# Altium schematic sheet DCDC_4805.SchDoc: 48-5V DC/DC Converter
size Letter; Author: William Peyton; Organization: Colorado School of Mines; Address1: 1500 Illinois St.; Address2: Golden; Address3: CO 80401; Address4: USA; DocumentNumber: 2; Revision: 1.0; SheetNumber: 1; SheetTotal: 1
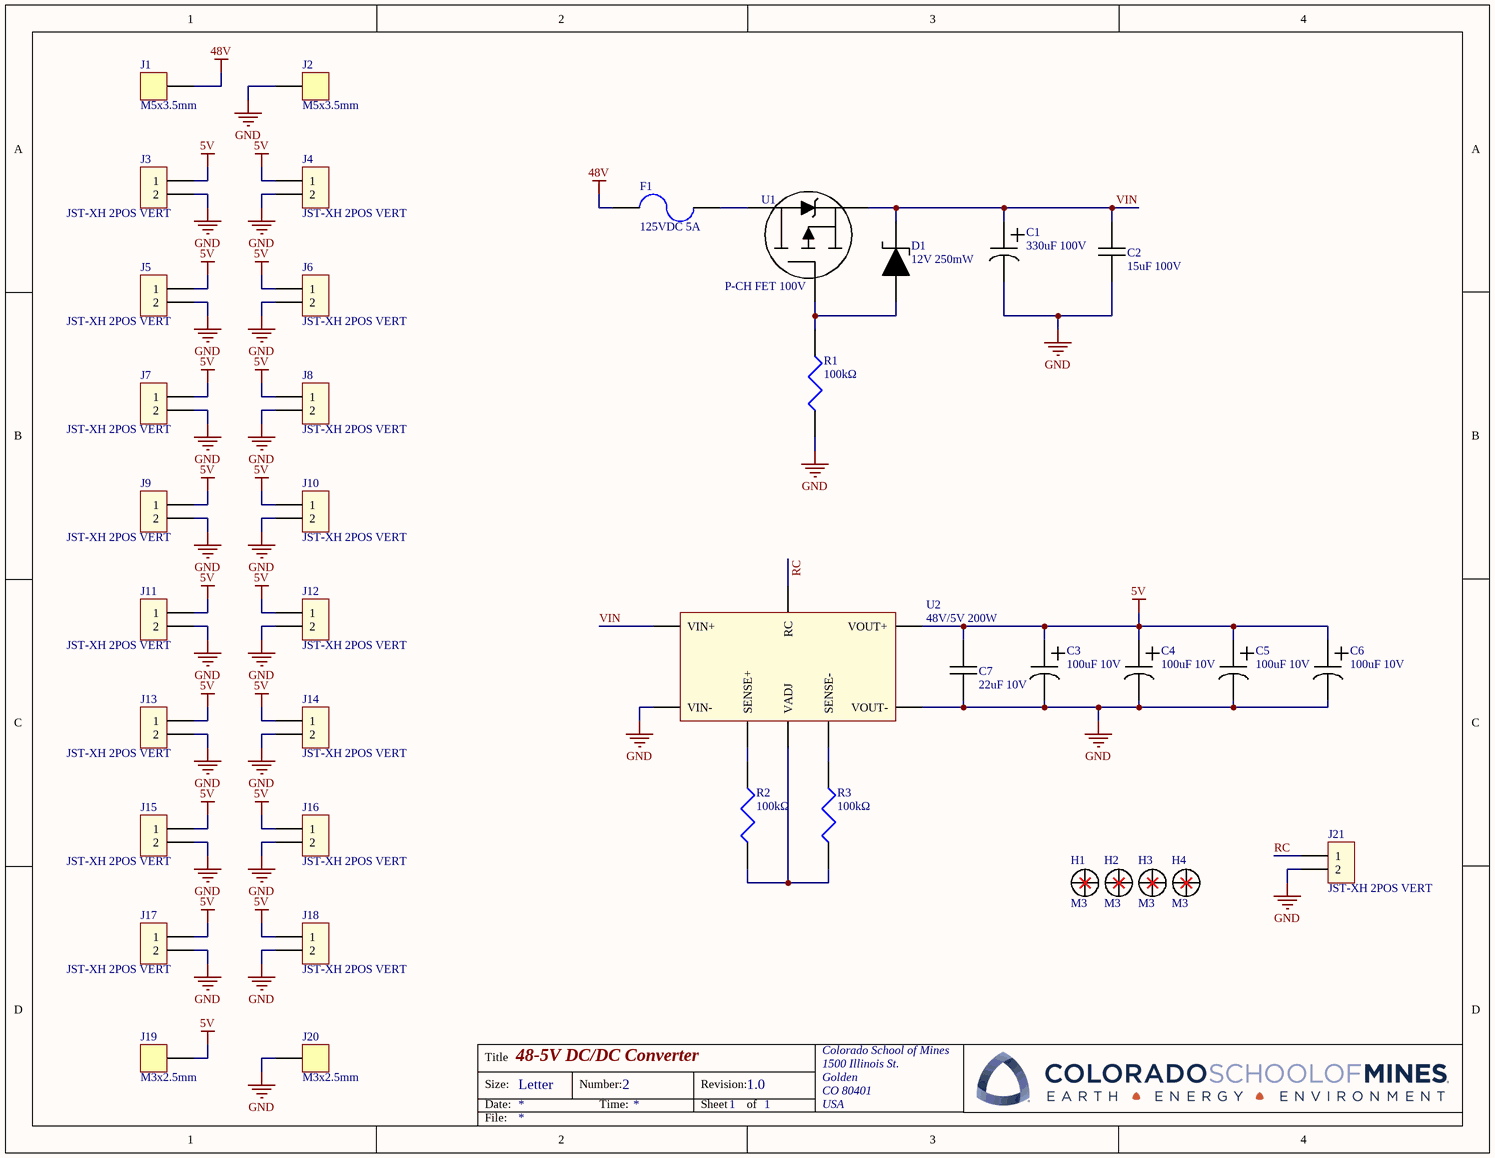
[diagram p0: DCDC_4805.SchDoc]

## Parts
C1  330uF 100V  [EEV-FK2A331M]
C2  15uF 100V  [C2220M Generic]
C3  100uF 10V  [865080243007]
C4  100uF 10V  [865080243007]
C5  100uF 10V  [865080243007]
C6  100uF 10V  [865080243007]
C7  22uF 10V  [885012107011]
D1  12V 250mW  [BZX84-C12,235]
F1  125VDC 5A  [0154005.DRL]
H1  M3  [M3_MOUNTING_HOLE]
H2  M3  [M3_MOUNTING_HOLE]
H3  M3  [M3_MOUNTING_HOLE]
H4  M3  [M3_MOUNTING_HOLE]
J1  M5x3.5mm  [74655095]
J2  M5x3.5mm  [74655095]
J3  JST-XH 2POS VERT  [FP-B2B-XH-A_LF_SN-MFG]
J4  JST-XH 2POS VERT  [FP-B2B-XH-A_LF_SN-MFG]
J5  JST-XH 2POS VERT  [FP-B2B-XH-A_LF_SN-MFG]
J6  JST-XH 2POS VERT  [FP-B2B-XH-A_LF_SN-MFG]
J7  JST-XH 2POS VERT  [FP-B2B-XH-A_LF_SN-MFG]
J8  JST-XH 2POS VERT  [FP-B2B-XH-A_LF_SN-MFG]
J9  JST-XH 2POS VERT  [FP-B2B-XH-A_LF_SN-MFG]
J10  JST-XH 2POS VERT  [FP-B2B-XH-A_LF_SN-MFG]
J11  JST-XH 2POS VERT  [FP-B2B-XH-A_LF_SN-MFG]
J12  JST-XH 2POS VERT  [FP-B2B-XH-A_LF_SN-MFG]
J13  JST-XH 2POS VERT  [FP-B2B-XH-A_LF_SN-MFG]
J14  JST-XH 2POS VERT  [FP-B2B-XH-A_LF_SN-MFG]
J15  JST-XH 2POS VERT  [FP-B2B-XH-A_LF_SN-MFG]
J16  JST-XH 2POS VERT  [FP-B2B-XH-A_LF_SN-MFG]
J17  JST-XH 2POS VERT  [FP-B2B-XH-A_LF_SN-MFG]
J18  JST-XH 2POS VERT  [FP-B2B-XH-A_LF_SN-MFG]
J19  M3x2.5mm  [74650073]
J20  M3x2.5mm  [74650073]
J21  JST-XH 2POS VERT  [FP-B2B-XH-A_LF_SN-MFG]
R1  100kΩ  [RMCF0805]
R2  100kΩ  [RMCF0805]
R3  100kΩ  [RMCF0805]
U1  P-CH FET 100V  [IRF9530NSTRLPBF]
U2  48V/5V 200W  [PKB4211DPI]

## Nets
5V: C3.1 C4.1 C5.1 C6.1 C7.1 J3.1 J4.1 J5.1 J6.1 J7.1 J8.1 J9.1 J10.1 J11.1 J12.1 J13.1 J14.1 J15.1 J16.1 J17.1 J18.1 J19.1 U2.8(VOUT+)
48V: F1.1 J1.1
GND: C1.2 C2.1 C3.2 C4.2 C5.2 C6.2 C7.2 J2.1 J3.2 J4.2 J5.2 J6.2 J7.2 J8.2 J9.2 J10.2 J11.2 J12.2 J13.2 J14.2 J15.2 J16.2 J17.2 J18.2 J20.1 J21.2 R1.1 U2.3(VIN-) U2.4(VOUT-)
RC: J21.1 U2.2(RC)
VIN: C1.1 C2.2 D1.3 U1.3 U2.1(VIN+)
NetD1_1: D1.1 R1.2 U1.1
NetF1_2: F1.2 U1.4
NetR2_1: R2.1 R3.1 U2.6(VADJ)
NetR2_2: R2.2 U2.7(SENSE+)
NetR3_2: R3.2 U2.5(SENSE-)

Not connected (* = marked no-connect by the designer): H1 1*; H2 1*; H3 1*; H4 1*

## Notes on the sheet
- Title
- Size:
- Date:
- Letter
- Number:
- Time:
- Revision:
- Sheet
- of
- File:

## Library data of the parts
C1 = EEV-FK2A331M: Panasonic CAP ALUM 330UF 20% 100V SMD; Manufacturer: Panasonic Electronic Components; ComponentLink1Description: DigiKey; ComponentLink1URL: https://www.digikey.com/en/products/detail/panasonic-electronic-components/EEV-FK2A331M/408248; Part Number: EEV-FK2A331M; Value: 330uF 100V
C2 = C5750X7S2A156M250KB: TDK CAP CER 15UF 100V X7S 2220; Manufacturer: TDK Corporation; ComponentLink1Description: DigiKey; ComponentLink1URL: https://www.digikey.com/en/products/detail/tdk-corporation/C5750X7S2A156M250KB/2443522; Part Number: C5750X7S2A156M250KB; Value: 15uF 100V
C3-C6 = 865080243007: Wurth CAP ALUM POLY 100UF 20% 10V SMD; Manufacturer: Würth Elektronik; ComponentLink1Description: DigiKey; ComponentLink1URL: https://www.digikey.com/en/products/detail/w%C3%BCrth-elektronik/865080243007/5728085; Part Number: 865080243007; Value: 100uF 10V
C7 = 885012107011: Wurth CAP CER 22UF 10V X5R 0805; Manufacturer: Würth Elektronik; Part Number: 885012107011; Value: 22uF 10V; ComponentLink1Description: DigiKey; ComponentLink1URL: https://www.digikey.com/en/products/detail/w%C3%BCrth-elektronik/885012107011/5453476
D1 = BZX84-C12,235: Nexperia DIODE ZENER 12V 250MW TO236AB; ComponentLink1Description: DigiKey; ComponentLink1URL: https://www.digikey.com/en/products/detail/nexperia-usa-inc/BZX84-C12-235/5221767; Part Number: BZX84-C12,235; Manufacturer: Nexperia; Value: 12V 250mW
F1 = 0154005.DRL: Littelfuse FUSE BRD MNT 5A 125VAC/VDC 2SMD; Part Number: 0456030.ER0154005.DRL; Manufacturer: Littelfuse; Value: 125VDC 5A; ComponentLink1Description: DigiKey; ComponentLink1URL: https://www.digikey.com/en/products/detail/littelfuse-inc/0154005-DRL/2520370
H1-H4 = M3_Mounting_Hole: MECHANICAL M3 Mounting Hole
J1 J2 = 74655095R: Wurth WP-THRBU REDCUBE THR internal through-hole thread, 10x10mm, M5x3.5mm, 8 pins, 85A; Manufacturer: Wurth Elektronik; Pin Number: 8; Thread: M5; Surface: Tin; Thread Length: 3.5mm; ComponentLink1Description: Manufacturer; ComponentLink1URL: http://www.we-online.de; ComponentLink2Description: Datasheet; ComponentLink2URL: https://katalog.we-online.com/em/datasheet/74655095R.pdf; Operating Temperature: -55 to +150degC; Height: 4mm; Material: Brass; Part Number: 74655095R; Packaging: Tape and Reel; Mounting Technology: SMT; Rated Current: 85A; Publisher: Wurth Elektronik; Published Date: September 2019; Size: 10x10mm; Value: M5x3.5mm
J3-J18 J21 = B2B-XH-A(LF)(SN): JST XH CONN HEADER VERT 2POS 2.5MM; ComponentLink2Description: Datasheet; ComponentLink2URL: http://www.jst-mfg.com/product/pdf/eng/eXH.pdf?5d9b3ba19c79b; Manufacturer: JST; Part Number: B2B-XH-A(LF)(SN); Value: JST-XH 2POS VERT
J19 J20 = 74650073R: Wurth WP-THRBU REDCUBE THR internal through-hole thread, 7x7mm, M3x2.5mm, 4 pins, 50A; Manufacturer: Wurth Elektronik; Pin Number: 4; Thread: M3; Surface: Tin; Thread Length: 2.5mm; ComponentLink1Description: Manufacturer; ComponentLink1URL: http://www.we-online.de; ComponentLink2Description: Datasheet; ComponentLink2URL: https://katalog.we-online.com/em/datasheet/74650073R.pdf; Operating Temperature: -55 to +150degC; Height: 3mm; Material: Brass; Part Number: 74650073R; Packaging: Tape and Reel; Mounting Technology: SMT; Rated Current: 50A; Publisher: Wurth Elektronik; Published Date: September 2019; Size: 7x7mm; Value: M3x2.5mm
R1-R3 = RMCF0805FT100K: Stackpole RES 100K OHM 1% 1/8W 0805; Manufacturer: Stackpole Electronics Inc; Part Number: RMCF0805FT100K; Value: 100kΩ
U1 = IRF9530NSTRLPBF: Infineon MOSFET P-CH 100V 14A D2PAK; Manufacturer: Infineon Technologies; Part Number: IRF9530NSTRLPBF; Value: P-CH FET 100V; ComponentLink1Description: DigiKey; ComponentLink1URL: https://www.digikey.com/en/products/detail/infineon-technologies/IRF4905STRLPBF/2440973
U2 = PKB4211DPI: Flex Power DC DC CONVERTER 5V 200W; Manufacturer: Flex Power Modules; Part Number: PKB4211DPI; Value: 48V/5V 200W; ComponentLink1Description: DigiKey; ComponentLink1URL: https://www.digikey.com/en/products/detail/flex-power-modules/PKB4211DPI/10287630